# Altium schematic sheet Front_ECU.SchDoc
size A4
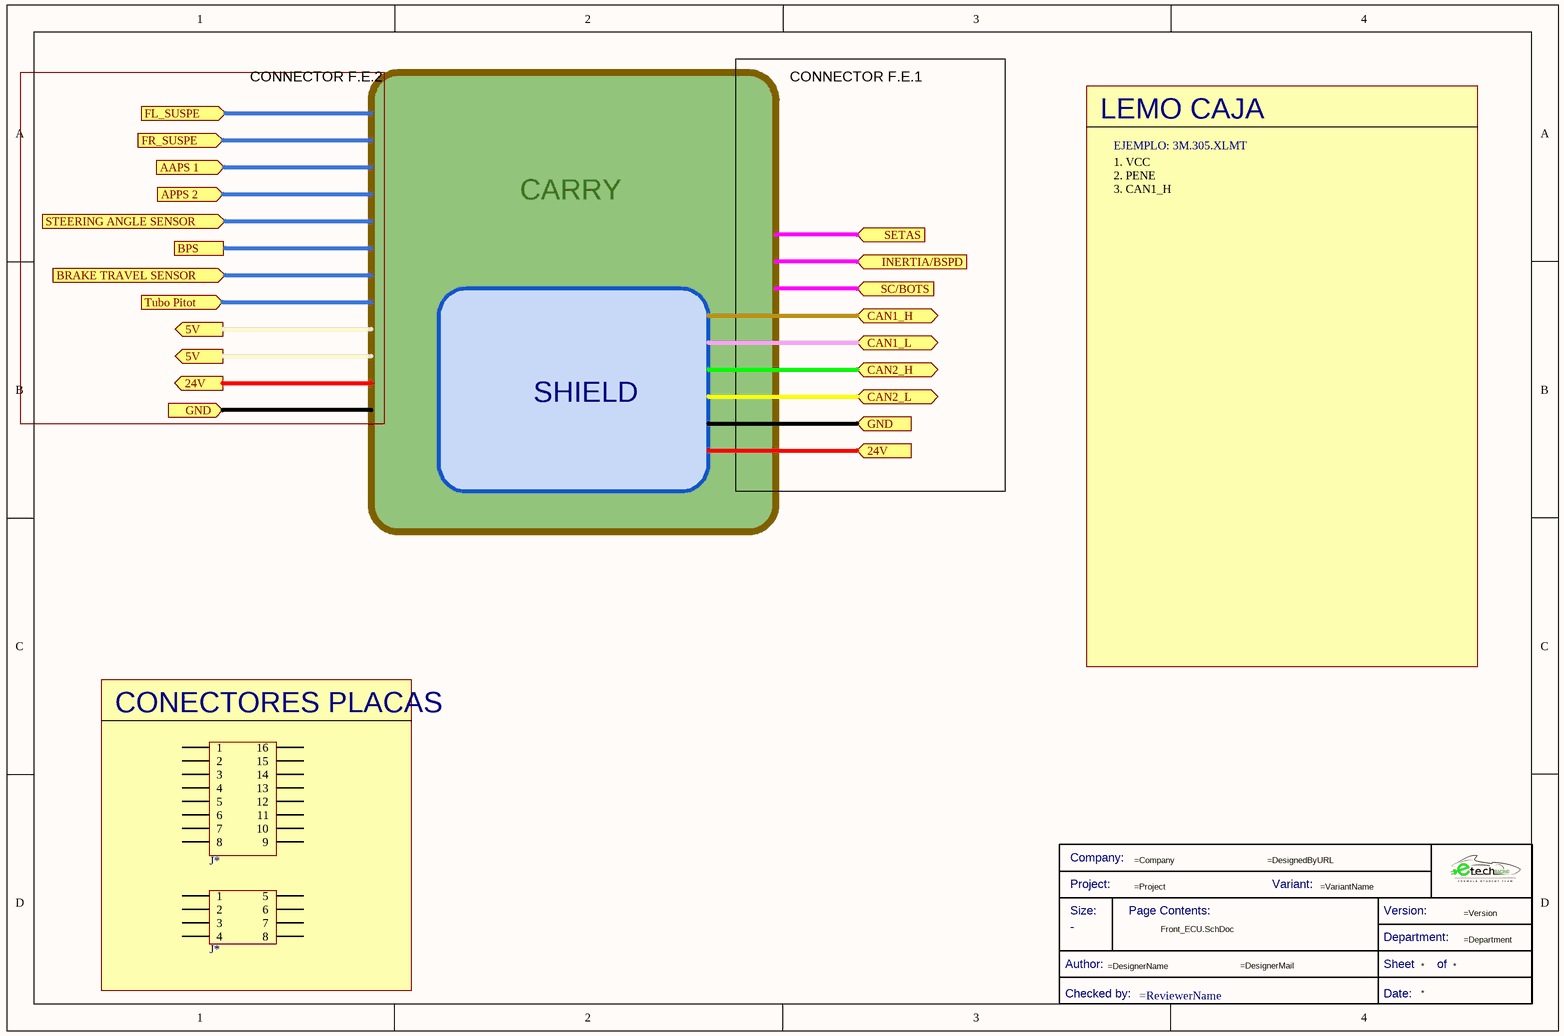
[diagram p0: Front_ECU.SchDoc]

## Parts
(Parts that share a designator on the sheet are numbered #1, #2 ... from top to bottom, then left to right.)
*?  Title Block_template  (value not drawn)  (graphical)
J*#1  1053141116  [J_NanoFit_2x8]  (value not drawn)
J*#2  0430450800  [J_MicroFit_2x4]  (value not drawn)

## Blocks framed on the sheet
CONECTORES PLACAS: J*#1 J*#2

## Ports
5V (out), 24V (in), 24V (out), AAPS 1 (in), APPS 2 (in), BPS (in), BRAKE TRAVEL SENSOR (in), CAN1_H (bidir), CAN1_L (bidir), CAN2_H (bidir), CAN2_L (bidir), FL_SUSPE (in), FR_SUSPE (in), GND (in), INERTIA/BSPD (in), SC/BOTS (in), SETAS (in), STEERING ANGLE SENSOR (in), Tubo Pitot (in)

## Nets

Not connected (* = marked no-connect by the designer): J*#1 1 2 3 4 5 6 7 8 9 10 11 12 13 14 15 16; J*#2 1 2 3 4 5 6 7 8

## Notes on the sheet
- CONNECTOR F.E.2
- CONNECTOR F.E.1
- LEMO CAJA
- EJEMPLO: 3M.305.XLMT
- CARRY
- 1. VCC          2. PENE        3. CAN1_H
- SHIELD
- (in symbol Title Block_template) Company:; Project:; Variant:; Size:; Page Contents:; Version:; Department:; Author:; Sheet; of; Checked by:; Date:

## Library data of the parts
*? = Title Block_template: Standard Title Block; .Creator: GP; Category: Title Block; .PCBcheck: GP; .SCHcheck: GP; Checked by:: =ReviewerName; Size: -
J*#1 = J_NanoFit_2x8: Nano-Fit Right Angle Header Through Hole 2.50mm Pitch Dual Row 16 Circuits Tin (Sn) Plating Black; Manufacturer: Molex; Manufacturer Part Number: 105314-1116; .Creator: DO; ComponentLink1URL: https://www.molex.com/pdm_docs/ps/PS-105300-100-001.pdf?src-supplier=Digi-Key; ComponentLink1Description: https://www.molex.com/pdm_docs/ps/PS-105300-100-001.pdf?src-supplier=Digi-Key; ComponentLink2Description: Where buy it; ComponentLink2URL: https://www.molex.com/molex/products/part-detail/pcb_headers/1053141116; Supplier 1: Newark; RoHS: Yes; Category: Headers and Wire Housings; Stock 1: 366; Pricing 1: 1=3,37000, 10=3,24000, 25=2,88000, 50=2,81000, 100=2,73000, 250=2,44000 (USD); Supplier Part Number 1: 33AC7692
J*#2 = J_MicroFit_2x4: Connector Wire to Board Header 8 Position 3mm Solder Right Angle Thru-Hole Tray; Manufacturer 1: Molex; .Creator: GP; Supplier 1: Arrow Electronics; Manufacturer Part Number 1: 0430450800; RoHS: Yes; Category: Headers and Wire Housings; Stock 1: 47494; Pricing 1: 1=2,57150, 10=2,34190, 25=2,14460, 50=2,00330, 100=1,89490, 500=1,75400 (USD); Supplier Part Number 1: 43045-0800